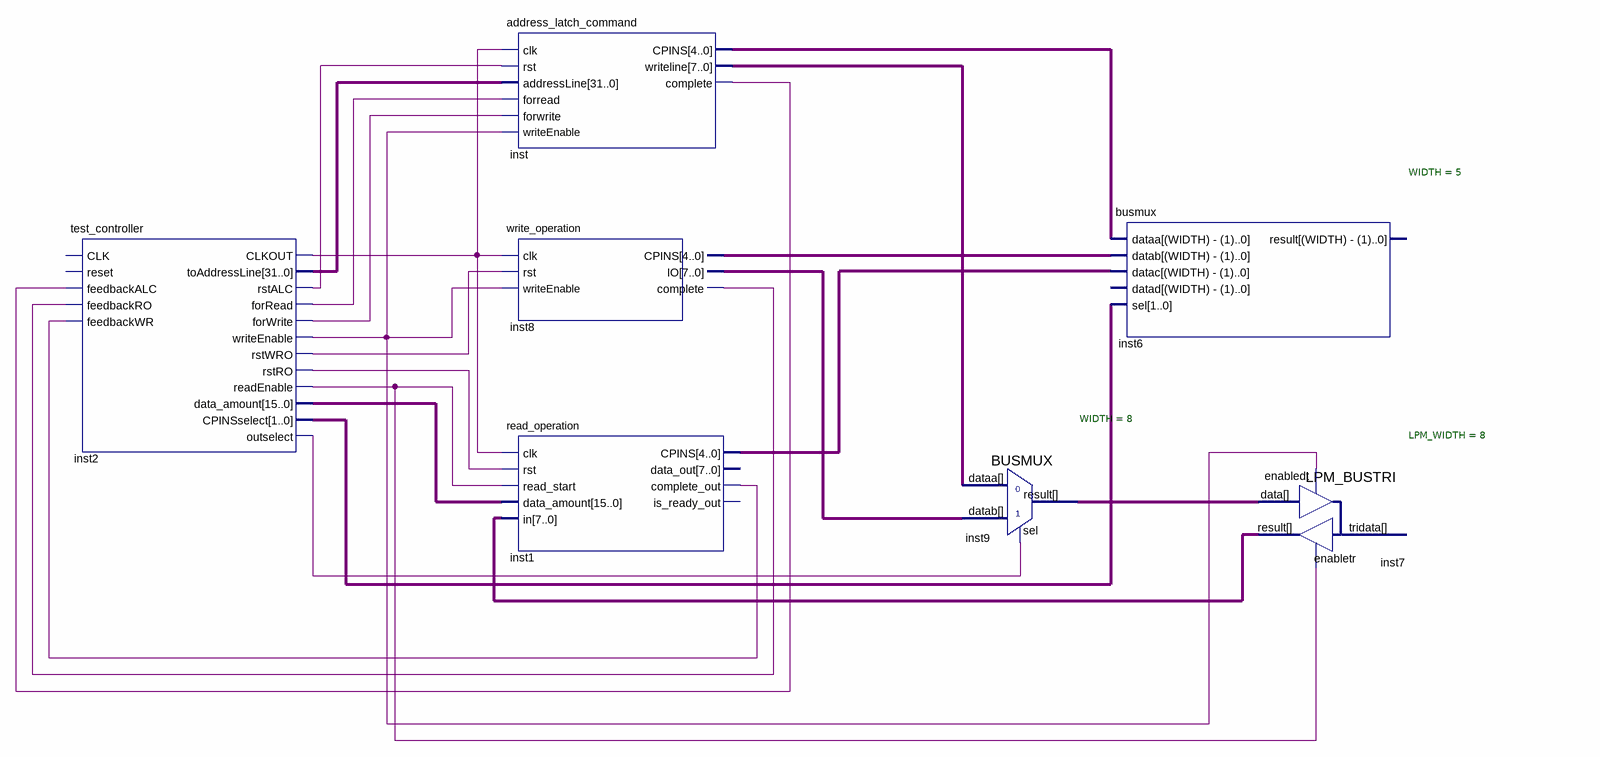
[diagram p0: schematic sheet]
// Quartus schematic address_latch_commandconstruct.bdf as structural Verilog: 7 symbols, 0 pins
module address_latch_commandconstruct (
);

  wire inst1_complete_out, inst2_clkout, inst2_forread, inst2_forwrite, inst2_outselect, inst2_readenable,
       inst2_rstalc, inst2_rstro, inst2_rstwro, inst2_writeenable, inst8_complete, inst_complete;
  wire [1:0] inst2_cpinsselect;
  wire [4:0] inst1_cpins, inst8_cpins, inst_cpins;
  wire [7:0] inst7_result, inst8_io, inst9_result, inst_writeline;
  wire [15:0] inst2_data_amount;
  wire [31:0] inst2_toaddressline;

  test_controller inst2 (
    .feedbackALC(inst_complete), .feedbackRO(inst8_complete), .feedbackWR(inst1_complete_out),
    .CLKOUT(inst2_clkout), .toAddressLine(inst2_toaddressline), .rstALC(inst2_rstalc),
    .forRead(inst2_forread), .forWrite(inst2_forwrite), .writeEnable(inst2_writeenable),
    .rstWRO(inst2_rstwro), .rstRO(inst2_rstro), .readEnable(inst2_readenable),
    .data_amount(inst2_data_amount), .CPINSselect(inst2_cpinsselect), .outselect(inst2_outselect));  // open: CLK, reset
  address_latch_command inst (
    .clk(inst2_clkout), .rst(inst2_rstalc), .addressLine(inst2_toaddressline), .forread(inst2_forread),
    .forwrite(inst2_forwrite), .writeEnable(inst2_writeenable), .CPINS(inst_cpins), .complete(inst_complete),
    .writeline(inst_writeline));
  write_operation inst8 (
    .clk(inst2_clkout), .rst(inst2_rstwro), .writeEnable(inst2_writeenable), .CPINS(inst8_cpins),
    .IO(inst8_io), .complete(inst8_complete));
  read_operation inst1 (
    .clk(inst2_clkout), .rst(inst2_rstro), .read_start(inst2_readenable), .data_amount(inst2_data_amount),
    .in(inst7_result), .CPINS(inst1_cpins), .complete_out(inst1_complete_out));  // open: data_out, is_ready_out
  BUSMUX #(.WIDTH(8)) inst9 (.datab(inst8_io), .sel(inst2_outselect), .dataa(inst_writeline), .result(inst9_result));
  busmux #(.WIDTH(5)) inst6 (
    .dataa(inst_cpins), .datab(inst8_cpins), .datac(inst1_cpins), .sel(inst2_cpinsselect));  // open: datad, result
  LPM_BUSTRI #(.LPM_WIDTH(8)) inst7 (
    .data(inst9_result), .enabledt(inst2_writeenable), .enabletr(inst2_readenable), .result(inst7_result));  // open: tridata
endmodule
